# EAGLE design thread_dongle (EAGLE 9.1.0)
AUTHOR: Joshua Adkins, Neal Jackson; REV: A; TITLE: Thread Dongle
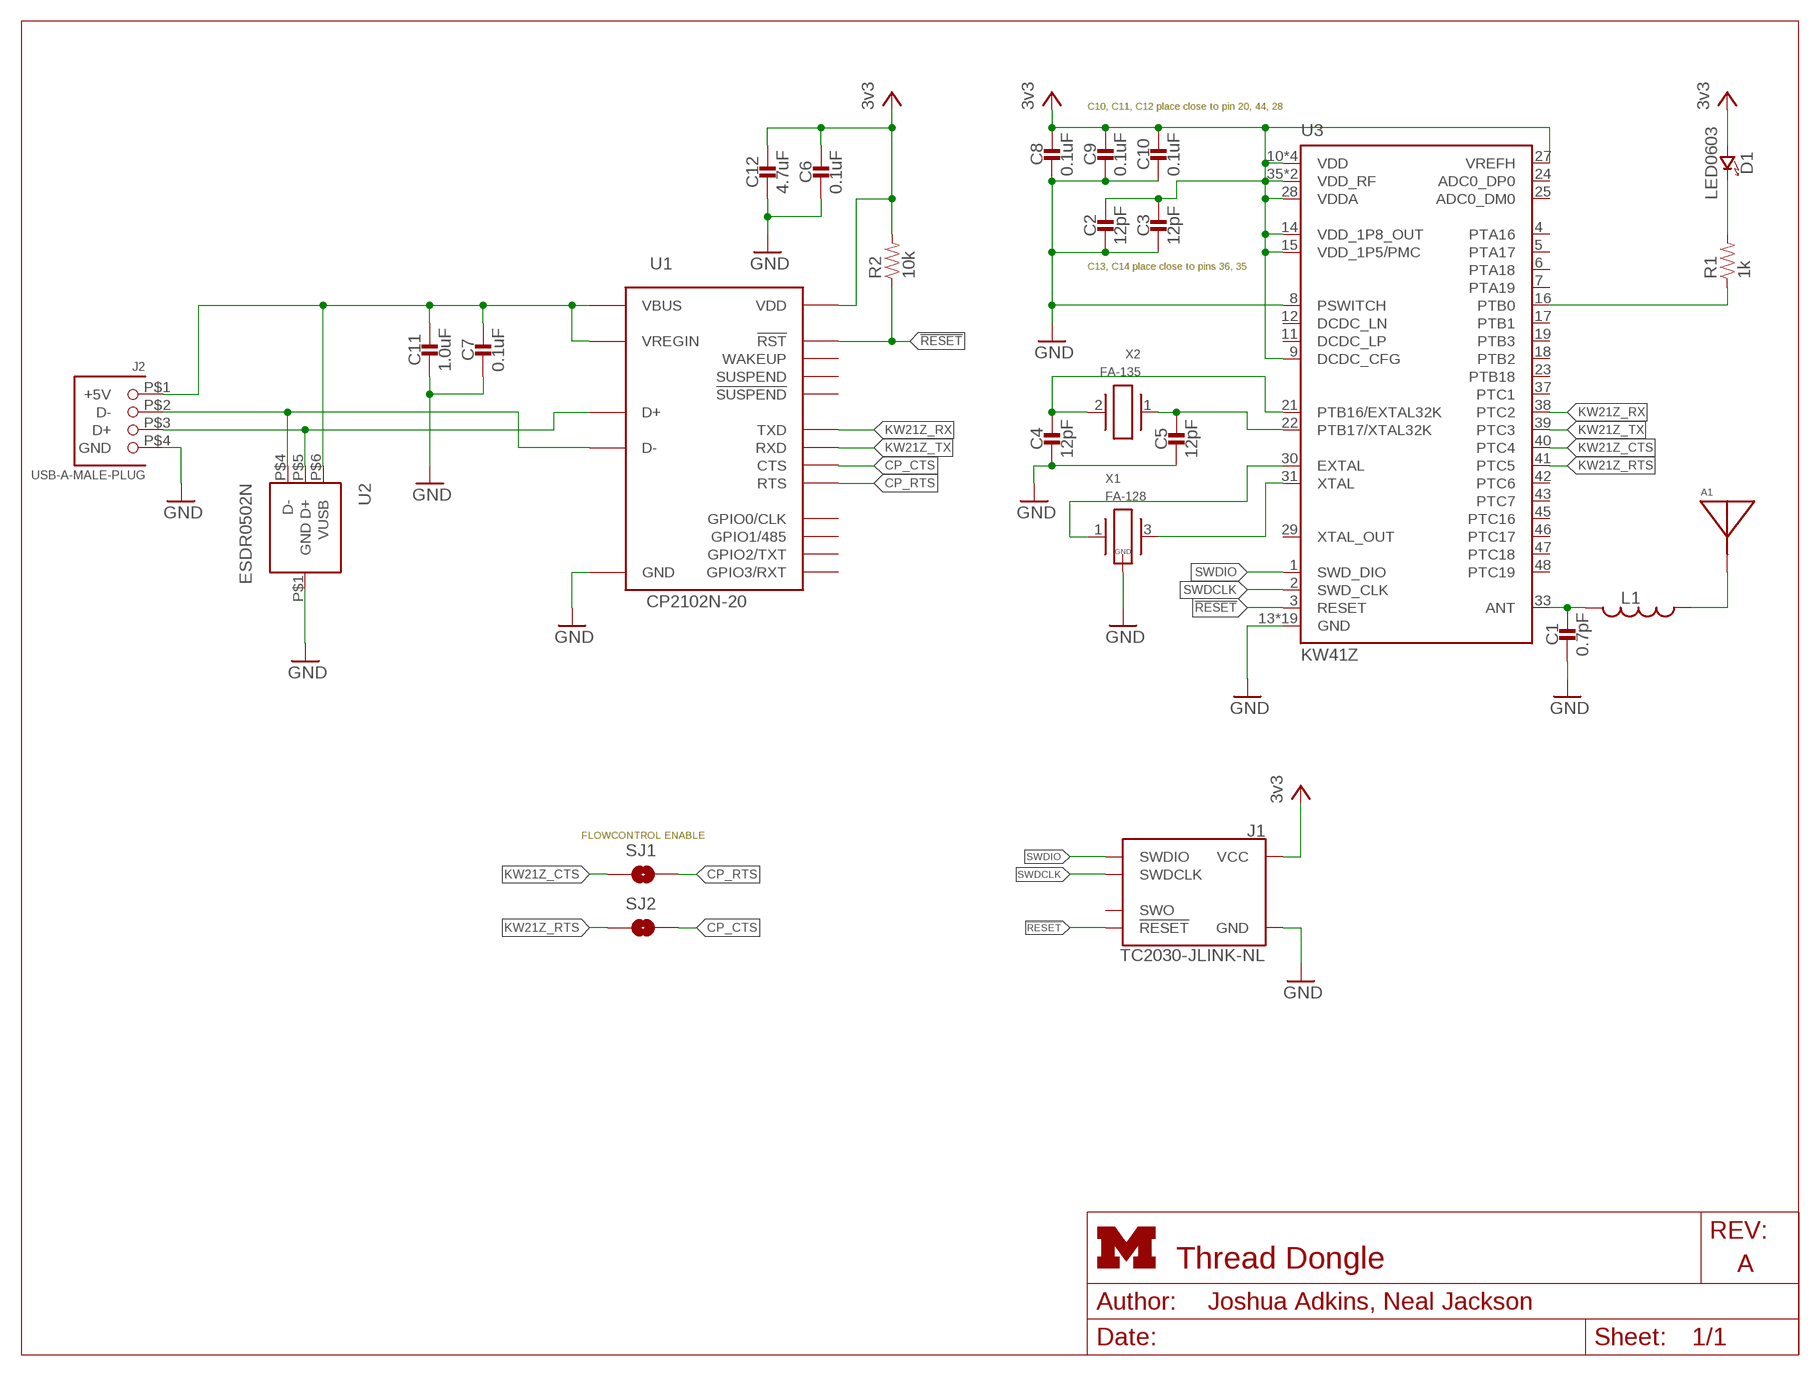
[diagram p0: schematic, sheet 1]
FRAME1 (LETTER_L_UMICH): HEIGHT: 8.5in; WIDTH: 11in

## Parts
A1  AH212M  [AH212M]
C1  0.7pF  CAPACITOR0402_CAP  [0402_CAP]
C2  12pF  CAPACITOR0402_CAP  [0402_CAP]
C3  12pF  CAPACITOR0402_CAP  [0402_CAP]
C4  12pF  CAPACITOR0402_CAP  [0402_CAP]
C5  12pF  CAPACITOR0402_CAP  [0402_CAP]
C6  0.1uF  CAPACITOR0402_CAP  [0402_CAP]
C7  0.1uF  CAPACITOR0402_CAP  [0402_CAP]
C8  0.1uF  CAPACITOR0402_CAP  [0402_CAP]
C9  0.1uF  CAPACITOR0402_CAP  [0402_CAP]
C10  0.1uF  CAPACITOR0402_CAP  [0402_CAP]
C11  1.0uF  CAPACITOR0402_CAP  [0402_CAP]
C12  4.7uF  CAPACITOR0402_CAP  [0402_CAP]
D1  LED0603  [LED-0603]
J1  TC2030-JLINK-NL  [TC2030-IDC-NL]
J2  USB-A-MALE-PLUG  [USB_A_MALE_PLUG_CUI_UP2-AH]
L1  INDUCTOR0402  [0402_CAP]
R1  1k  RESISTOR0402_RES  [0402_RES]
R2  10k  RESISTOR0402_RES  [0402_RES]
SJ1  SOLDERJUMPERNC  [SJ_2S_SMALL]
SJ2  SOLDERJUMPERNC  [SJ_2S_SMALL]
U1  CP2102N-20  [QFN-20-3MM]
U2  ESDR0502N  [UDFN-6]
U3  KW41Z  [LAMINATE-QFN-48-7MM]
X1  FA-128  [FA-128]
X2  FA-135  [FC-135]

## Nets
5V: C7.1 C11.1 J2.P$1(+5V) U1.7(VREGIN) U1.8(VBUS) U2.P$6(VUSB)
!RESET: J1.3(!RESET) R2.1 U1.9(!RST) U3.3(RESET)
CP_CTS: SJ2.2 U1.15(CTS)
CP_RTS: SJ1.2 U1.16(RTS)
D+: J2.P$3(D+) U1.4(D+) U2.P$5(D+)
D-: J2.P$2(D-) U1.5(D-) U2.P$4(D-)
GND: C1.2 C2.2 C3.2 C4.2 C5.2 C6.2 C7.2 C8.2 C9.2 C10.2 C11.2 C12.2 J1.5(GND) J2.P$4(GND) U1.3(GND) U1.12(GND) U1.P$1(GND) U2.P$1(GND) U3.8(PSWITCH) U3.13(GND) U3.26(GND) U3.34(GND) U3.49(GND) U3.50(GND) U3.51(GND) U3.52(GND) U3.53(GND) U3.54(GND) U3.55(GND) U3.56(GND) U3.57(GND) U3.58(GND) U3.59(GND) U3.60(GND) U3.61(GND) U3.62(GND) U3.63(GND) U3.64(GND) X1.2(GND) X1.4(GND)
KW21Z_CTS: SJ1.1 U3.40(PTC4)
KW21Z_RTS: SJ2.1 U3.41(PTC5)
KW21Z_RX: U1.18(TXD) U3.38(PTC2)
KW21Z_TX: U1.17(RXD) U3.39(PTC3)
N$1: C4.1 U3.21(PTB16/EXTAL32K) X2.2
N$2: C5.1 U3.22(PTB17/XTAL32K) X2.1
N$3: U3.31(XTAL) X1.3
N$7: D1.C(CATHODE) R1.2
N$8: R1.1 U3.16(PTB0)
N$12: U3.30(EXTAL) X1.1
N$13: C1.1 L1.2 U3.33(ANT)
N$16: A1.P1(ANTENNA) L1.1
SWDCLK: J1.4(SWDCLK) U3.2(SWD_CLK)
SWDIO: J1.2(SWDIO) U3.1(SWD_DIO)
VCC: C2.1 C3.1 C6.1 C8.1 C9.1 C10.1 C12.1 D1.A(ANODE) J1.1(VCC) R2.2 U1.6(VDD) U3.9(DCDC_CFG) U3.10(VDD) U3.14(VDD_1P8_OUT) U3.15(VDD_1P5/PMC) U3.20(VDD) U3.27(VREFH) U3.28(VDDA) U3.32(VDD) U3.35(VDD_RF) U3.36(VDD_RF) U3.44(VDD) ; supply symbol labelled 3v3
Unconnected: J1.6(SWO) U1.1(GPIO1/485) U1.2(GPIO0/CLK) U1.11(!SUSPEND) U1.13(WAKEUP) U1.14(SUSPEND) U1.19(GPIO3/RXT) U1.20(GPIO2/TXT) U3.4(PTA16) U3.5(PTA17) U3.6(PTA18) U3.7(PTA19) U3.11(DCDC_LP) U3.12(DCDC_LN) U3.17(PTB1) U3.18(PTB2) U3.19(PTB3) U3.23(PTB18) U3.24(ADC0_DP0) U3.25(ADC0_DM0) U3.29(XTAL_OUT) U3.37(PTC1) U3.42(PTC6) U3.43(PTC7) U3.45(PTC16) U3.46(PTC17) U3.47(PTC18) U3.48(PTC19)

## Notes on the sheet
- C10, C11, C12 place close to pin 20, 44, 28
- C13, C14 place close to pins 36, 35
- FLOWCONTROL ENABLE

## Library data of the parts
A1 = chips:AH212M: Small 2.4Ghz chip antenna; DIGIKEY: 587-2725-1-ND; MPN: AH212M245001-T
C1 = passives:CAPACITOR: SMD Capacitor; DIGIKEY: 490-6267-1-ND; MPN: GRM1555C1HR70BA01D
C2-C5 = passives:CAPACITOR: SMD Capacitor; DIGIKEY: 490-5924-1-ND; MPN: GRM1555C1H120JA01D
C6-C10 = passives:CAPACITOR: SMD Capacitor; DIGIKEY: 587-1227-1-ND; MPN: LMK105BJ104KV-F
C11 = passives:CAPACITOR: SMD Capacitor; DIGIKEY: 490-10018-1-ND; MPN: GRM155R61E105MA12D
C12 = passives:CAPACITOR: SMD Capacitor; DIGIKEY: 490-5915-1-ND; MPN: GRM155R60J475ME47D
D1 = leds:LED: LED; DIGIKEY: 160-1837-6-ND; MPN: LTST-C194TBKT
J1 = connector:TC2030-JLINK
J2 = connector:USB-A-MALE-PLUG: USB A Male plug connector; DIGIKEY: 102-3996-ND; MANUFACTURER: CUI; MPN: UP2-AH-1-TH
L1 = passives:INDUCTOR: A very specific inductor; DIGIKEY: 490-6573-1-ND; MPN: LQG15HS5N1S02D
R1 = passives:RESISTOR: Resistor Basic schematic elements and footprints for 0201, 0402, 0603, 1206, and PTH resistors.; DIGIKEY: 311-1.0KJRCT-ND; MPN: RC0402JR-071KL
R2 = passives:RESISTOR: Resistor Basic schematic elements and footprints for 0201, 0402, 0603, 1206, and PTH resistors.; DIGIKEY: 311-10KJRCT-ND; MPN: RC0402JR-0710KL
SJ1 SJ2 = headers:SOLDERJUMPER: Solder Jumper Standard SMD solder jumper. Used to automate production. Two varients : Normally Open and Normally Closed are the same, but have different paste layers. NC will have a large amount of paste and should jumper during reflow.
U1 = chips:CP2102N-20: A cheap, simple USB to UART adapter; DIGIKEY: 336-3692-ND; MANUFACTURER: SiLabs; MPN: CP2102N-A01-GQFN20
U2 = chips:ESDR0502N; DIGIKEY: ESDR0502NMUTBGOSCT-ND; MPN: ESDR0502NMUTBG
U3 = chips:KW41Z: NXP KW21Z Cortex M0+ 802.15.4; DIGIKEY: MKW41Z512VHT4-ND; MPN: MKW41Z512VHT4
X1 = crystals:FA-128: Epson MHz RANGE CRYSTAL UNIT ULTRA MINIATURE SIZE LOW PROFILE SMD http://www.digikey.com/product-search/en?FV=ffec63d1; DIGIKEY: SER4079CT-ND; MPN: FA-128 32.0000MF20X-K5
X2 = crystals:FA-135: Epson kHz RANGE CRYSTAL UNIT ULTRA MINIATURE SIZE LOW PROFILE SMD https://www.digikey.com/products/en/crystals-oscillators-resonators/crystals/171?k=fc-135; DIGIKEY: SER4086CT-ND; MPN: FC-135 32.7680KA-AG3

## Board
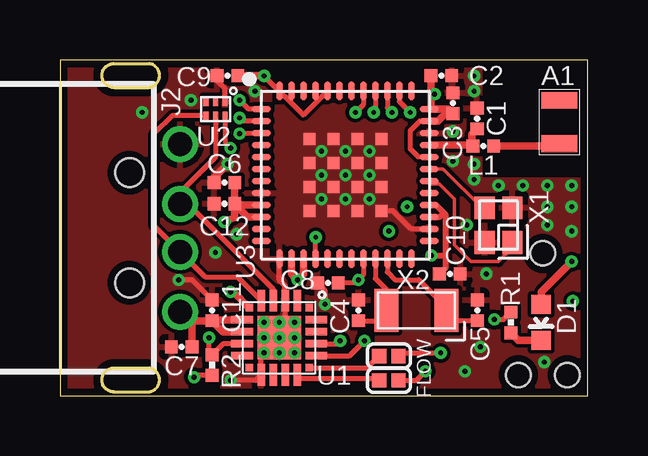
[diagram p1: board, top side]
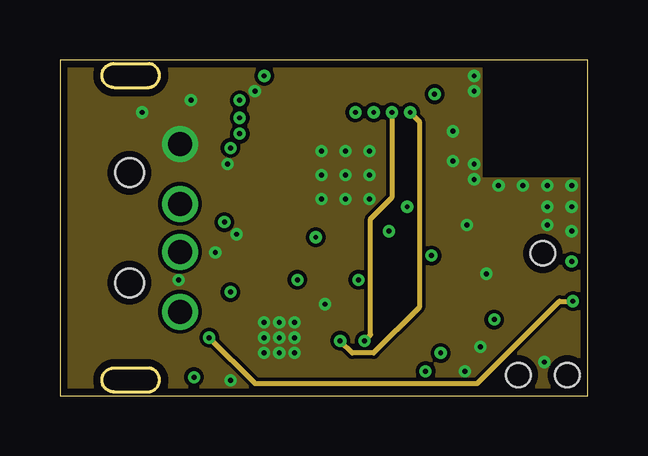
[diagram p2: board, inner layer Route2]
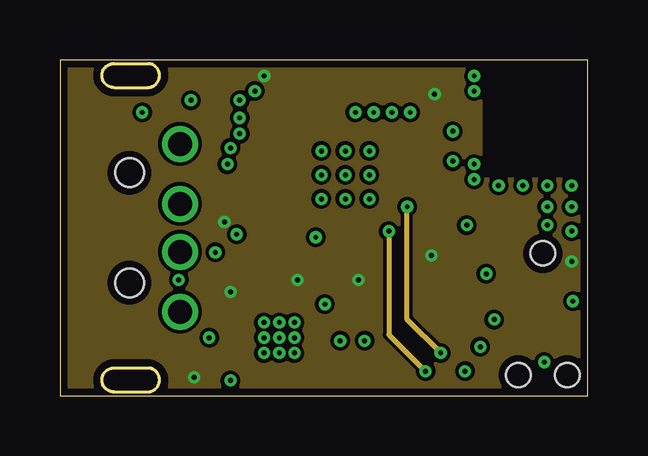
[diagram p3: board, inner layer Route15]
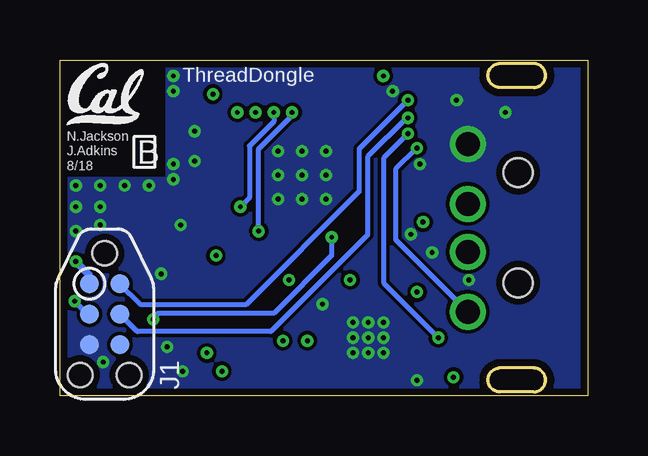
[diagram p4: board, bottom side, seen from below]

Size 22 x 14 mm. Coordinates in mm from the lower left corner, seen from the top.
Outline: 0,0 22,0 22,14 0,14 0,0
Copper layers (1+2*15+16): Top 0.0178mm / dielectric 59mil / Route2 0.0356mm / dielectric 0.1499mm / Route15 0.0356mm / dielectric 0.2007mm / Bottom 0.0178mm
Design rules "quickturn_co_kr_1oz_4lyr *": minimum track width 6mil, minimum drill 8mil, track to track 6mil, track to pad 6mil, pad to pad 6mil, via to via 6mil, smd to smd 6mil, copper to edge 12mil, drill to drill 12mil, minimum pad ring 8mil, minimum via ring 6mil, stop-mask expansion 3mil, vias tented up to drill 50mil, thermal gap 10mil

### Footprints (pad centres in the part's own frame; a part is rotated, then mirrored left to right if it is on the bottom)
AH212M = smd 1.5 x 0.7: P1 0,0.35; P2 0,2.15
0402_CAP = smd 0.536 x 0.546: 1 -0.433,0; 2 0.433,0
LED-0603 = smd 0.8 x 0.8: A 0,-0.75; C 0,0.75
TC2030-IDC-NL = smd 0.787 x 0.787: 1 -1.27,-0.635; 2 -1.27,0.635; 3 0,-0.635; 4 0,0.635; 5 1.27,-0.635; 6 1.27,0.635 | hole 1.016: -2.54,0; 2.54,1.016; 2.54,-1.016
USB_A_MALE_PLUG_CUI_UP2-AH = drill 1: P$1 3.5,5; P$2 1,5; P$3 -1,5; P$4 -3.5,5 | hole 1.2: -2.3,2.9; 2.3,2.9
0402_RES = smd 0.536 x 0.546: 1 -0.433,0; 2 0.433,0
SJ_2S_SMALL = smd 0.6 x 0.6: 1 -0.4,0; 2 0.4,0
QFN-20-3MM = smd 0.3 x 0.3: 1 -1.25,1.25; 6 -1.25,-1.25; 11 1.25,-1.25; 16 1.25,1.25 | smd 0.9 x 0.3: 2 -1.55,0.75; 3 -1.55,0.25; 4 -1.55,-0.25; 5 -1.55,-0.75; 12 1.55,-0.75; 13 1.55,-0.25; 14 1.55,0.25; 15 1.55,0.75 | smd 0.3 x 0.9: 7 -0.75,-1.55; 8 -0.25,-1.55; 9 0.25,-1.55; 10 0.75,-1.55; 17 0.75,1.55; 18 0.25,1.55; 19 -0.25,1.55; 20 -0.75,1.55 | smd 1.8 x 1.8: P$1 0,0
UDFN-6 = smd 0.42 x 0.22: P$1 -0.325,0.4; P$2 -0.325,0; P$3 -0.325,-0.4; P$4 0.325,-0.4; P$5 0.325,0; P$6 0.325,0.4
LAMINATE-QFN-48-7MM = smd 0.8 x 0.28: 1 -3.5,2.75; 2 -3.5,2.25; 3 -3.5,1.75; 4 -3.5,1.25; 5 -3.5,0.75; 6 -3.5,0.25; 7 -3.5,-0.25; 8 -3.5,-0.75; 9 -3.5,-1.25; 10 -3.5,-1.75; 11 -3.5,-2.25; 12 -3.5,-2.75; 25 3.5,-2.75; 26 3.5,-2.25; 27 3.5,-1.75; 28 3.5,-1.25; 29 3.5,-0.75; 30 3.5,-0.25; 31 3.5,0.25; 32 3.5,0.75; 33 3.5,1.25; 34 3.5,1.75; 35 3.5,2.25; 36 3.5,2.75 | smd 0.28 x 0.8: 13 -2.75,-3.5; 14 -2.25,-3.5; 15 -1.75,-3.5; 16 -1.25,-3.5; 17 -0.75,-3.5; 18 -0.25,-3.5; 19 0.25,-3.5; 20 0.75,-3.5; 21 1.25,-3.5; 22 1.75,-3.5; 23 2.25,-3.5; 24 2.75,-3.5; 37 2.75,3.5; 38 2.25,3.5; 39 1.75,3.5; 40 1.25,3.5; 41 0.75,3.5; 42 0.25,3.5; 43 -0.25,3.5; 44 -0.75,3.5; 45 -1.25,3.5; 46 -1.75,3.5; 47 -2.25,3.5; 48 -2.75,3.5 | smd 0.5 x 0.5: 49 -1.5,1.5; 50 -0.5,1.5; 51 0.5,1.5; 52 1.5,1.5; 53 -1.5,0.5; 54 -0.5,0.5; 55 0.5,0.5; 56 1.5,0.5; 57 -1.5,-0.5; 58 -0.5,-0.5; 59 0.5,-0.5; 60 1.5,-0.5; 61 -1.5,-1.5; 62 -0.5,-1.5; 63 0.5,-1.5; 64 1.5,-1.5
FA-128 = smd 0.95 x 0.85: 1 -0.725,-0.575; 2 0.725,-0.575; 3 0.725,0.575; 4 -0.725,0.575
FC-135 = smd 1 x 1.8: 1 -1.25,0; 2 1.25,0

### Placement (x,y rotation side)
A1  20.82,10.16 0 top
C1  17.39,11.56 90 top
C2  15.9,13.34 0 top
C3  16.38,12.19 90 top
C4  12.45,3.56 90 top
C5  17.4,3.56 90 top
C6  6.86,8.89 180 top
C7  5.08,2.03 180 top
C8  11.17,4.7 180 top
C9  6.99,13.34 180 top
C10  16.26,5.08 0 top
C11  6.35,3.56 90 top
C12  6.86,8 180 top
D1  20.07,3.05 180 top
J1  20.14,3.4 270 bottom
J2  0,7 270 top
L1  17.65,10.41 180 top
R1  18.8,3.05 270 top
R2  6.35,1.27 270 top
SJ1  13.72,1.65 180 top
SJ2  13.72,0.64 180 top
U1  9.14,2.41 270 top
U2  6.49,11.96 270 top
U3  11.9,9.2 0 top
U$1  [UCB_CAL_100MIL]  21.72,11.3 0 bottom
X1  18.29,7.11 90 top
X2  14.86,3.56 180 top

### Tracks (layer width: path | path; a pad name or v marks a point on that pad's centre or on a via)
5V  (via drill 0.2)
  Top 0.203: v7.11,10.33 6.89,10.55 U2.P$6
  Top 0.305: J2.P$1 5.38,3.12 5.59,3.12 | 5.59,3.12 C11.1 | U1.8 6.81,2.66 C11.1 | U1.7 6.39,3.16 C11.1 | C7.1 5.51,3.05 5.59,3.12
  Bottom 0.203: J2.P$1 8,6.5 8,9.44 v7.11,10.33
!RESET  (via drill 0.2)
  Top 0.203: U1.9 6.81,2.16 R2.1 6.22,1.83 v6.22,2.41 | U3.3 8.37,10.92 v7.49,10.92
  Route2 0.203: v6.22,2.41 8.13,0.51 17.4,0.51 20.83,3.94 v21.39,3.94
  Bottom 0.203: v6.22,2.41 8.51,4.7 8.51,9.91 v7.49,10.92 | J1.3 20.92,3.4 20.92,3.47 v21.39,3.94
CP_CTS
  Top 0.203: U1.15 10.03,0.72 13.23,0.72 SJ2.2
CP_RTS
  Top 0.203: U1.16 12.81,1.16 13.3,1.65 SJ1.2
D+
  Top 0.203: U1.4 8.89,4.44 5.33,8 J2.P$3 5,8.47 6.49,9.96 U2.P$5
D-
  Top 0.203: U1.5 7.4,4.95 6.05,4.95 J2.P$2 3.94,7.06 3.94,10.92 4.7,11.68 6.03,11.68 U2.P$4
GND  (via drill 0.2)
  Top 0.203: C11.2 5.51,4.83 v4.95,4.83 | C8.2 11.05,4.39 v11.05,3.81 | U3.13 9.14,4.83 9.39,4.58 U1.3 9.39,3.3 v9.14,3.05 | U2.P$1 6.89,12.8 6.55,13.13 C9.2 | v8.51,1.78 8.39,1.66 U1.12 8.17,0.64 v7.11,0.64 | U3.26 14.64,6.95 13.89,7.7 U3.64
  Top 0.305: C6.2 6.42,9.09 v6.99,9.65
  other vias: 17.53,2.03 16.89,1.02 20.19,1.4 17.27,12.7 17.27,13.34 17.27,9.65 17.27,9.02 18.29,8.76 19.3,8.76 20.32,8.76 21.34,8.76 10.9,8.2 11.9,8.2 12.9,8.2 12.9,9.2 11.9,9.2 10.9,9.2 10.9,10.2 11.9,10.2 12.9,10.2 17.78,5.08 21.34,7.87 20.32,7.87 21.34,6.86 20.32,7.11 16.38,9.78 16.38,11.02 6.48,5.97 5.46,12.32 3.43,11.81 8.13,12.7 9.14,2.41 8.51,2.41 8.51,3.05 9.78,3.05 9.78,2.41 9.78,1.78 9.14,1.78 16.97,7.11 7.37,6.73
  pour Top (isolate 0.102): -1.52,0 -1.52,14 17.51,14 17.51,9 22,9 21.92,0
  pour Route2 (isolate 0.102, no thermals): -1.02,0 -1.02,14.1 17.51,14 17.51,9 22,9 21.92,0
  pour Bottom (isolate 0.102, no thermals): 0,0 0,14.1 17.51,14 17.51,9 22,9 21.92,0
  pour Top (rank 2, no thermals): 9.91,11.18 13.97,11.18 13.97,7.24 9.91,7.24
KW21Z_CTS  (via drill 0.2)
  Top 0.203: 14.23,1.78 SJ1.1 14.24,1.78 v15.88,1.78 | U3.40 13.15,11.88 v13.08,11.81
  Route15 0.203: v15.88,1.78 14.48,3.17 v14.48,7.87
  Bottom 0.203: v13.08,11.81 13.08,11.43 14.1,10.41 14.1,8.26 v14.48,7.87
KW21Z_RTS  (via drill 0.2)
  Top 0.203: SJ2.1 14.86,0.64 v15.24,1.02 | U3.41 12.65,12.14 v12.32,11.81
  Route15 0.203: v13.72,6.86 13.72,2.54 v15.24,1.02
  Bottom 0.203: v13.72,6.86 13.72,10.29 12.32,11.68 v12.32,11.81
KW21Z_RX  (via drill 0.2)
  Top 0.203: U1.18 11.56,2.16 v11.68,2.29 | U3.38 14.15,12.27 v14.61,11.81
  Route2 0.203: v11.68,2.29 12.19,1.78 13.08,1.78 14.99,3.68 14.99,11.43 v14.61,11.81
KW21Z_TX  (via drill 0.2)
  Top 0.203: U1.17 12.08,1.66 v12.7,2.29 | U3.39 13.65,12 v13.84,11.81
  Route2 0.203: v13.84,11.81 13.84,8.26 12.95,7.37 12.95,2.54 v12.7,2.29
N$1
  Top 0.203: U3.21 13.15,4.88 13.61,4.42 X2.2 13.18,3.12 C4.1
N$2
  Top 0.203: U3.22 13.65,5.15 13.97,4.83 14.97,4.83 16.11,3.68 X2.1 16.54,3.12 C5.1
N$3
  Top 0.152: U3.31 15.97,9.45 17.59,7.84 X1.3
N$7
  Top 0.305: R1.2 19.11,2.3 D1.C
N$8  (via drill 0.2)
  Top 0.203: U3.16 10.65,6.59 v10.67,6.6 | R1.1 18.49,3.17 v18.11,3.17
  Bottom 0.203: v10.67,6.6 10.67,5.84 13.08,3.43 17.91,3.43 18.11,3.23 v18.11,3.17
N$12
  Top 0.152: U3.30 15.53,8.82 15.81,8.82 16.44,8.19 16.44,6.29 17.14,5.59 18.29,5.59 18.86,6.16 X1.1
N$13
  Top 0.203: U3.33 15.47,10.41
  Top 0.305: U3.33 17.18,10.45 | 17.18,10.45 L1.2 | C1.1 17.18,10.91 17.18,10.45
N$16
  Top 0.305: L1.1 20.73,10.41 A1.P1
SWDCLK  (via drill 0.2)
  Top 0.203: U3.2 7.62,11.45 v7.49,11.58
  Bottom 0.203: J1.4 18.77,2.67 13.21,2.67 9.17,6.71 9.17,9.96 7.55,11.58 v7.49,11.58
SWDIO  (via drill 0.2)
  Top 0.203: U3.1 7.86,11.95 v7.49,12.32
  Bottom 0.203: J1.2 18.64,3.81 14.22,3.81 9.53,8.51 9.53,10.29 v7.49,12.32
VCC  (via drill 0.2)
  Top 0.203: R2.2 5.66,0.84 v5.59,0.76 | U3.20 12.65,5.03 v12.45,4.83 12.32,4.7 C8.1 11.56,4.65 | U3.32 14.94,9.95 14.61,10.29 14.61,11.05 15.01,11.45 U3.35 | U3.44 10.15,11.7 v8.52,13.33
  Top 0.254: U3.27 15.83,7.45 16,7.62 | U3.28 15.67,7.95 16,7.62 | 16.08,5.84 16.08,7.54 16,7.62 | 16.08,5.84 16.08,5.33 C10.1 | v15.49,5.84 16.08,5.84
  Top 0.305: C2.1 15.47,12.45 | 15.47,12.45 15.47,12.02 U3.36 16.19,11.95 16.23,11.91 | v15.62,12.57 15.59,12.57 15.47,12.45 | D1.A 20.07,4.32 v21.34,5.59 | U3.9 7.34,7.95 C12.1 | U3.10 7.83,7.45 C12.1 | U1.6 7.24,4.32 v7.11,4.32 | C12.1 7.29,7.42 v6.86,7.24 | C12.1 C6.1 | C9.1 v8.51,13.34 v8.52,13.33 | 16.23,11.91 C3.1 | U3.35 15.77,11.45 16.23,11.91 | U3.14 9.65,5.08 v9.91,4.83 10.15,5.07 U3.15
  Bottom 0.305: v21.34,5.59 20.77,5.02 J1.1
  pour Route15 (isolate 0.102, no thermals): -0.51,0 -0.51,14.1 17.51,14 17.51,9 22,9 21.92,0

### Text on the board
tPlace: FLOW
bPlace: ThreadDongle | B | N.Jackson / J.Adkins / 8/18